# Altium schematic sheet SD_CARD_REV2.SchDoc
size A4; SheetNumber: 6; SheetTotal: 11
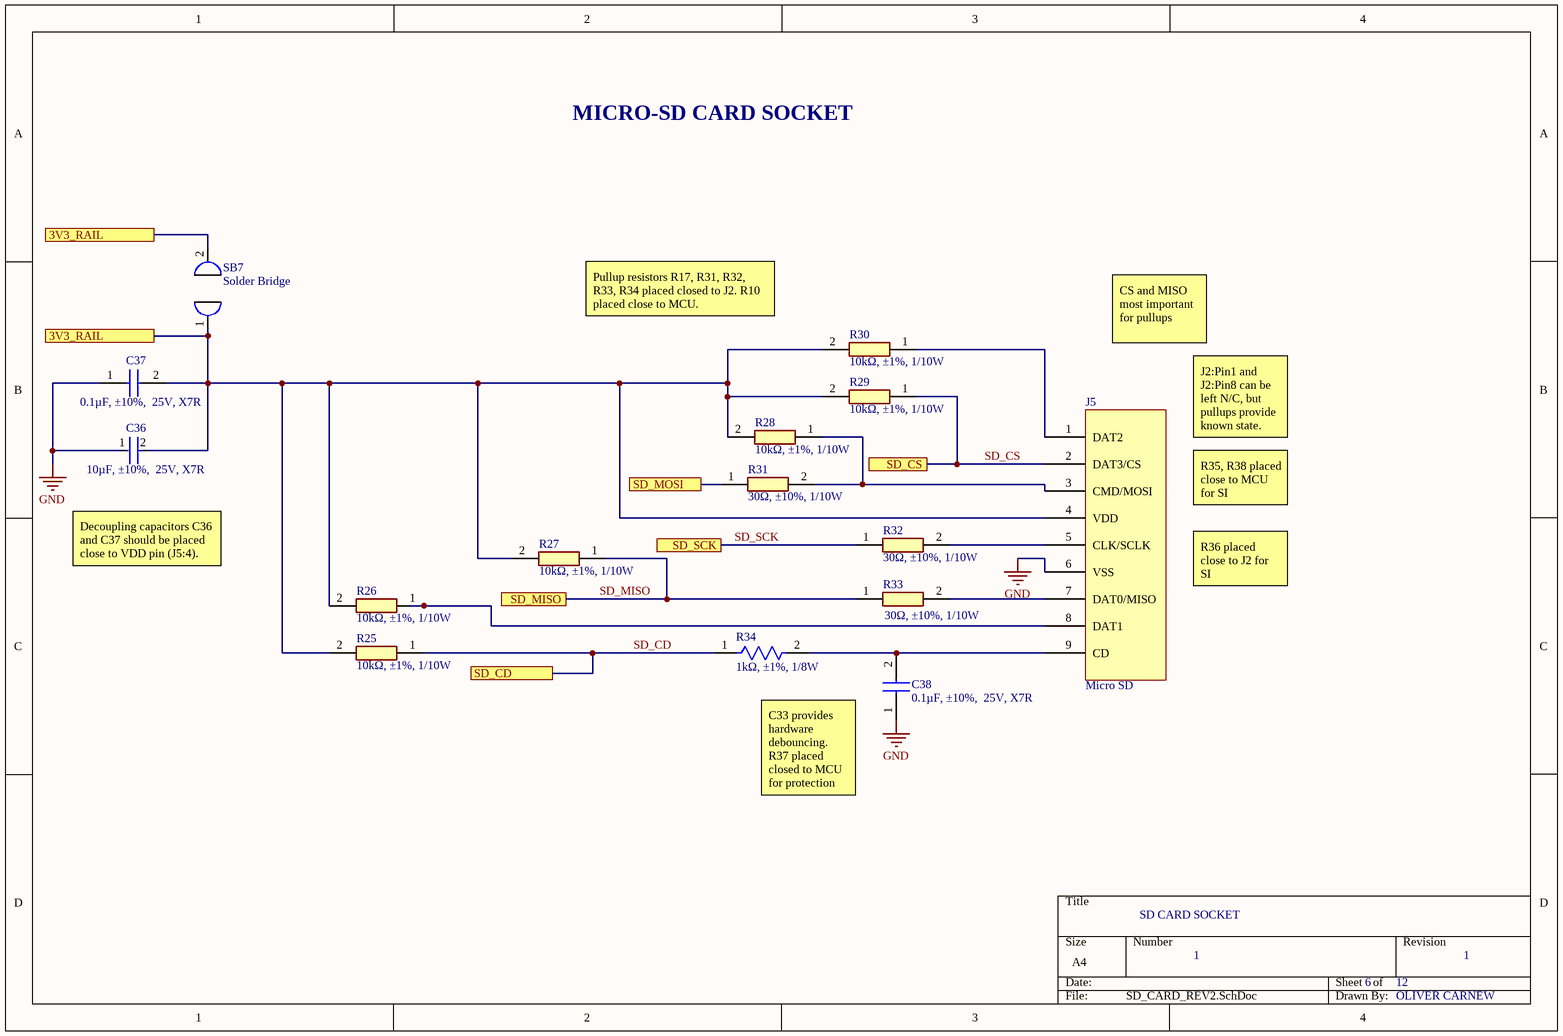
[diagram p0: SD_CARD_REV2.SchDoc]

## Parts
C36  10µF, ±10%,  25V, X7R  [FP-CL21B106KOQNNNE-MFG]
C37  0.1µF, ±10%,  25V, X7R  [CAPC1005X55N]
C38  0.1µF, ±10%,  25V, X7R  [CAPC1005X55N]
J5  Micro SD  [SD CARD]
R25  10kΩ, ±1%, 1/10W  [RESC2012X60N]
R26  10kΩ, ±1%, 1/10W  [RESC2012X60N]
R27  10kΩ, ±1%, 1/10W  [RESC2012X60N]
R28  10kΩ, ±1%, 1/10W  [RESC2012X60N]
R29  10kΩ, ±1%, 1/10W  [RESC2012X60N]
R30  10kΩ, ±1%, 1/10W  [RESC2012X60N]
R31  30Ω, ±10%, 1/10W  [RESC1608X55N]
R32  30Ω, ±10%, 1/10W  [RESC1608X55N]
R33  30Ω, ±10%, 1/10W  [RESC1608X55N]
R34  1kΩ, ±1%, 1/8W  [FP-RNCP0603-IPC_A]
SB7  Solder Bridge  [SOLDER BRIDGE OPEN SMALL]

## Ports
3V3_RAIL, SD_CD, SD_CS, SD_MISO, SD_MOSI, SD_SCK

## Nets
GND: C36.1 C37.1 C38.1 J5.6(VSS)
3V3_RAIL: C36.2 C37.2 J5.4(VDD) R25.2 R26.2 R27.2 R28.2 R29.2 R30.2 SB7.1 SB7.2 ; port 3V3_RAIL
SD_CD: R25.1 R34.1 ; port SD_CD
SD_CS: J5.2(DAT3/CS) R29.1 ; port SD_CS
SD_MISO: R27.1 R33.1 ; port SD_MISO
SD_MOSI: R31.1 ; port SD_MOSI
SD_SCK: R32.1 ; port SD_SCK
NetC38_2: C38.2 J5.9(CD) R34.2
NetJ5_1: J5.1(DAT2) R30.1
NetJ5_3: J5.3(CMD/MOSI) R28.1 R31.2
NetJ5_5: J5.5(CLK/SCLK) R32.2
NetJ5_7: J5.7(DAT0/MISO) R33.2
NetJ5_8: J5.8(DAT1) R26.1

## Notes on the sheet
- MICRO-SD CARD SOCKET
- Pullup resistors R17, R31, R32, R33, R34 placed closed to J2. R10 placed close to MCU.
- CS and MISO most important for pullups
- J2:Pin1 and J2:Pin8 can be left N/C, but pullups provide known state.
- R35, R38 placed close to MCU for SI
- Decoupling capacitors C36 and C37 should be placed close to VDD pin (J5:4).
- R36 placed close to J2 for SI
- C33 provides hardware debouncing. R37 placed closed to MCU for protection
- SD CARD SOCKET
- 1
- 6
- 12
- OLIVER CARNEW

## Library data of the parts
C36 = CMP-2000-06106-2: CAP CER 10UF 16V X7R 0805 CL21B106KOQNNNE; Manufacturer: Samsung Electro-Mechanics America, Inc; Material: Ceramic; Temperature Coefficient: 15%; Digikey Description: CAP CER 10UF 16V X7R 0805; Lead Free: Yes; ComponentLink2URL: http://www.samsungsem.com/servlet/FileDownload?path=productsearch&sname=CL21B106KOQNNNE.pdf&oname=CL21B106KOQNNNE.pdf; ComponentLink2Description: Datasheet; Temperature Range Low: -55°C; RoHS: TRUE; Category: Cap; Temperature Characteristic: X7R; Manufacturer Part Number: CL21B106KOQNNNE; Automotive: No; Octopart: https://octopart.com/cl21b106koqnnne-samsung-19832289; Device Class L3: Ceramic Capacitors; Temperature Range High: +125°C; Height: 1.4mm; Device Class L2: Capacitors; Voltage Rating: 16V; Value: 10uF; Temperature: -55°C to +125°C; Tolerance: 10%; Device Class L1: Passive Components; Ipc Land Pattern Name: CAPC200125X125; Package: CL21B106KOQNNNE; Capacitance: 10uF
C37 C38 = CL05B104KA5NNNC: Capacitor CAP CER 0.1UF 25V X7R 0402 CL05B104KA5NNNC; Manufacturer_Name: SAMSUNG; Datasheet Link: https://datasheet.datasheetarchive.com/originals/distributors/DKDS-19/372989.pdf; Height: 0.55mm; Manufacturer_Part_Number: CL05B104KA5NNNC; Mouser Part Number: 187-CL05B104KA5NNNC; Mouser Price/Stock: https://www.mouser.co.uk/ProductDetail/Samsung-Electro-Mechanics/CL05B104KA5NNNC?qs=Efv9o2T6U88DLyyMSzjXSQ%3D%3D; Arrow Part Number: CL05B104KA5NNNC; Arrow Price/Stock: https://www.arrow.com/en/products/cl05b104ka5nnnc/samsung-electro-mechanics?region=nac; Parameter 1: Capacitor CAP CER 0.1UF 25V X7R 0402 CL05B104KA5NNNC
J5 = SD_CARD_MICRO: ETSG
R25-R30 = RC0805JR-0710KL: Resistor RES 10K OHM 5% 1/8W 0805  RC0805JR-0710KL; Manufacturer_Name: YAGEO; Datasheet Link: https://componentsearchengine.com/Datasheets/2/RC0805JR-0710KL.pdf; Height: 0.6mm; Manufacturer_Part_Number: RC0805JR-0710KL; Mouser Part Number: 603-RC0805JR-0710KL; Mouser Price/Stock: https://www.mouser.co.uk/ProductDetail/YAGEO/RC0805JR-0710KL?qs=ZFGQJeMQzF5q%2Fp77vM%2FrVQ%3D%3D; Arrow Part Number: RC0805JR-0710KL; Arrow Price/Stock: https://www.arrow.com/en/products/rc0805jr-0710kl/yageo?region=nac
R31-R33 = ERJPA3F30R0V: Resistor ERJPA3F30R0V 30 Ohms ±1% 0.333W, 1/3W Chip Resistor 0603 (1608 Metric) Automotive AEC-Q200, Pulse Withstanding Thick Film; Manufacturer_Name: Panasonic; Datasheet Link: https://industrial.panasonic.com/cdbs/www-data/pdf/RDA0000/AOA0000C243.pdf; Height: 0.55mm; Manufacturer_Part_Number: ERJPA3F30R0V; Arrow Part Number: ERJPA3F30R0V; Arrow Price/Stock: https://www.arrow.com/en/products/erj-pa3f30r0v/panasonic; Parameter 1: Resistor ERJPA3F30R0V 30 Ohms ±1% 0.333W, 1/3W Chip Resistor 0603 (1608 Metric) Automotive AEC-Q200, Pulse Withstanding Thick Film
R34 = CMP-26527-006179-1: 1kΩ ±1% 0.125W 0603 High Power Anti-Sulfur Thin Film Chip Resistor RNCP0603FTD1K00; Temperature Coefficient: 100ppm/°C; Max Power Dissipation: 125mW; Resistance: 1kR; Case/Package: 0603; Width: 0.031inch; Tolerance: 1%; Case Code (Imperial): 0603; RoHS Compliant: Yes; Min Operating Temperature: -55°C; Resistor Type: Thin Film; Features: Moisture Resistant; Length: 0.059inch; Mount: Surface Mount; Case Code (Metric): 1608; Height: 0.02inch; Max Operating Temperature: 155°C; Packaging: Tape and Reel; Series: RNCP; Number of Terminations: 2
SB7 = SOLDER_BRIDGE_TDROP: Tension Fill Solder Bridge